# EAGLE schematic EmergencyStop - RevA2 (EAGLE 7.7.0)
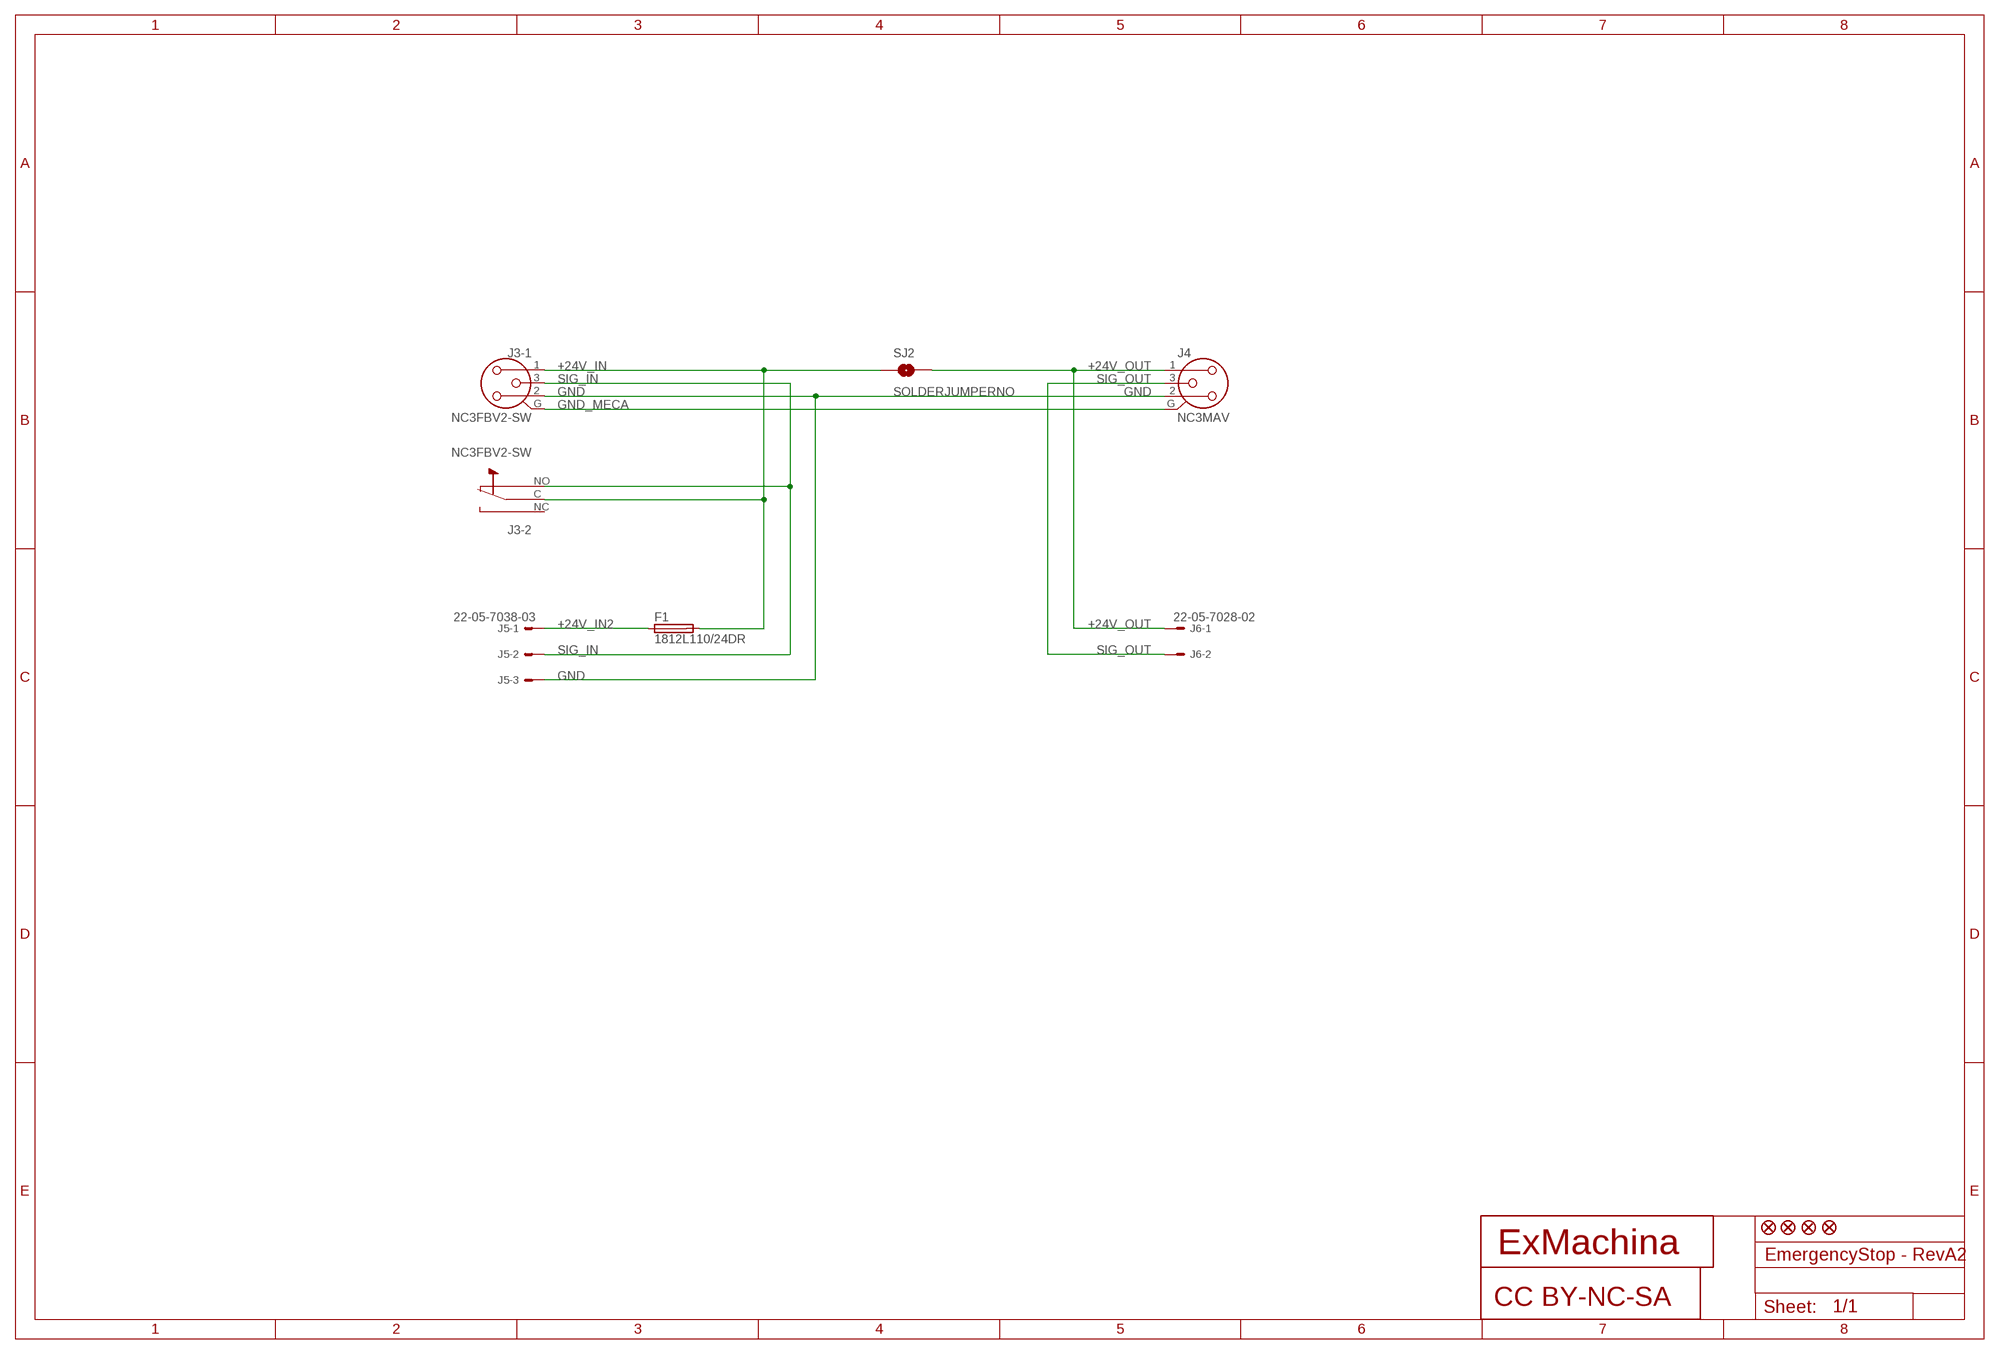
[diagram p0: schematic, sheet 1]

## Parts
CC1  CC-BY-NC-SA  [CC-BY-NC-SA]
F1  1812L110/24DR  [LITTLEFUSE_SMD]
J3  NC3FBV2-SW  [NC3FBV2-SW]
J4  NC3MAV  [NC3MAV]
J5  22-05-7038-03  [7395-03]
J6  22-05-7028-02  [7395-02]
JP1  FIDUCIAL1X2  [FIDUCIAL-1X2]
JP2  FIDUCIAL1X2  [FIDUCIAL-1X2]
JP3  FIDUCIAL1X2  [FIDUCIAL-1X2]
JP4  FIDUCIAL1X2  [FIDUCIAL-1X2]
SJ2  SOLDERJUMPERNO  [SJ_2S-NO]
T1  EXMACHINA-LOGO-NAME  [EXM-LOGO-BASELINE]

## Nets
+24V_IN: F1.2 J3.1 J3.C(-2:N) SJ2.1
+24V_IN2: F1.1 J5.1
+24V_OUT: J4.1 J6.1 SJ2.2
GND: J3.2 J4.2 J5.3
GND_MECA: J3.G(-1:G) J4.G
SIG_IN: J3.3 J3.NO(-2:NO) J5.2
SIG_OUT: J4.3 J6.2
Unconnected: J3.NC(-2:NC)

## Library data of the parts
CC1 = cc-by-sa:CC-BY-NC-SA
F1 = fuse2:1812L
J3 = con-neutrik_ag:NC3?-SW: Neutrik Audio Connector XLR SERIES Stereo 1/4" jack Source: www.neutrik.com/
J4 = con-neutrik_ag:NC3: Neutrik Audio Connector XLR SERIES Stereo 1/4" jack Source: www.neutrik.com/; MF: FARNELL; MPN: NC3MAV; OC_FARNELL: 724531; OC_NEWARK: 46WX3058
J5 = con-molex:22-?-03: CONNECTOR wire to board 2.54 mm (.1 inch) pitch header; OC_FARNELL: 9731610; OC_NEWARK: unknown
J6 = con-molex:22-?-02: CONNECTOR wire to board 2.54 mm (.1 inch) pitch header; OC_FARNELL: 9731601; OC_NEWARK: unknown
JP1-JP4 = SparkFun:FIDUCIAL: Fiducial Alignment Points Various fiducial points for machine vision alignment.
SJ2 = SparkFun-Passives:SOLDERJUMPER: Solder Jumper Standard SMD solder jumper. Used to automate production. Two varients : Normally Open and Normally Closed are the same, but have different paste layers. NC will have a large amount of paste and should jumper during reflow.
T1 = exmachina:EXMACHINA-LOGO

## Net classes
0 default: width 0.813 mm, drill 0.35 mm